# EAGLE design sc14cvm-evb (EAGLE 7.6.0)
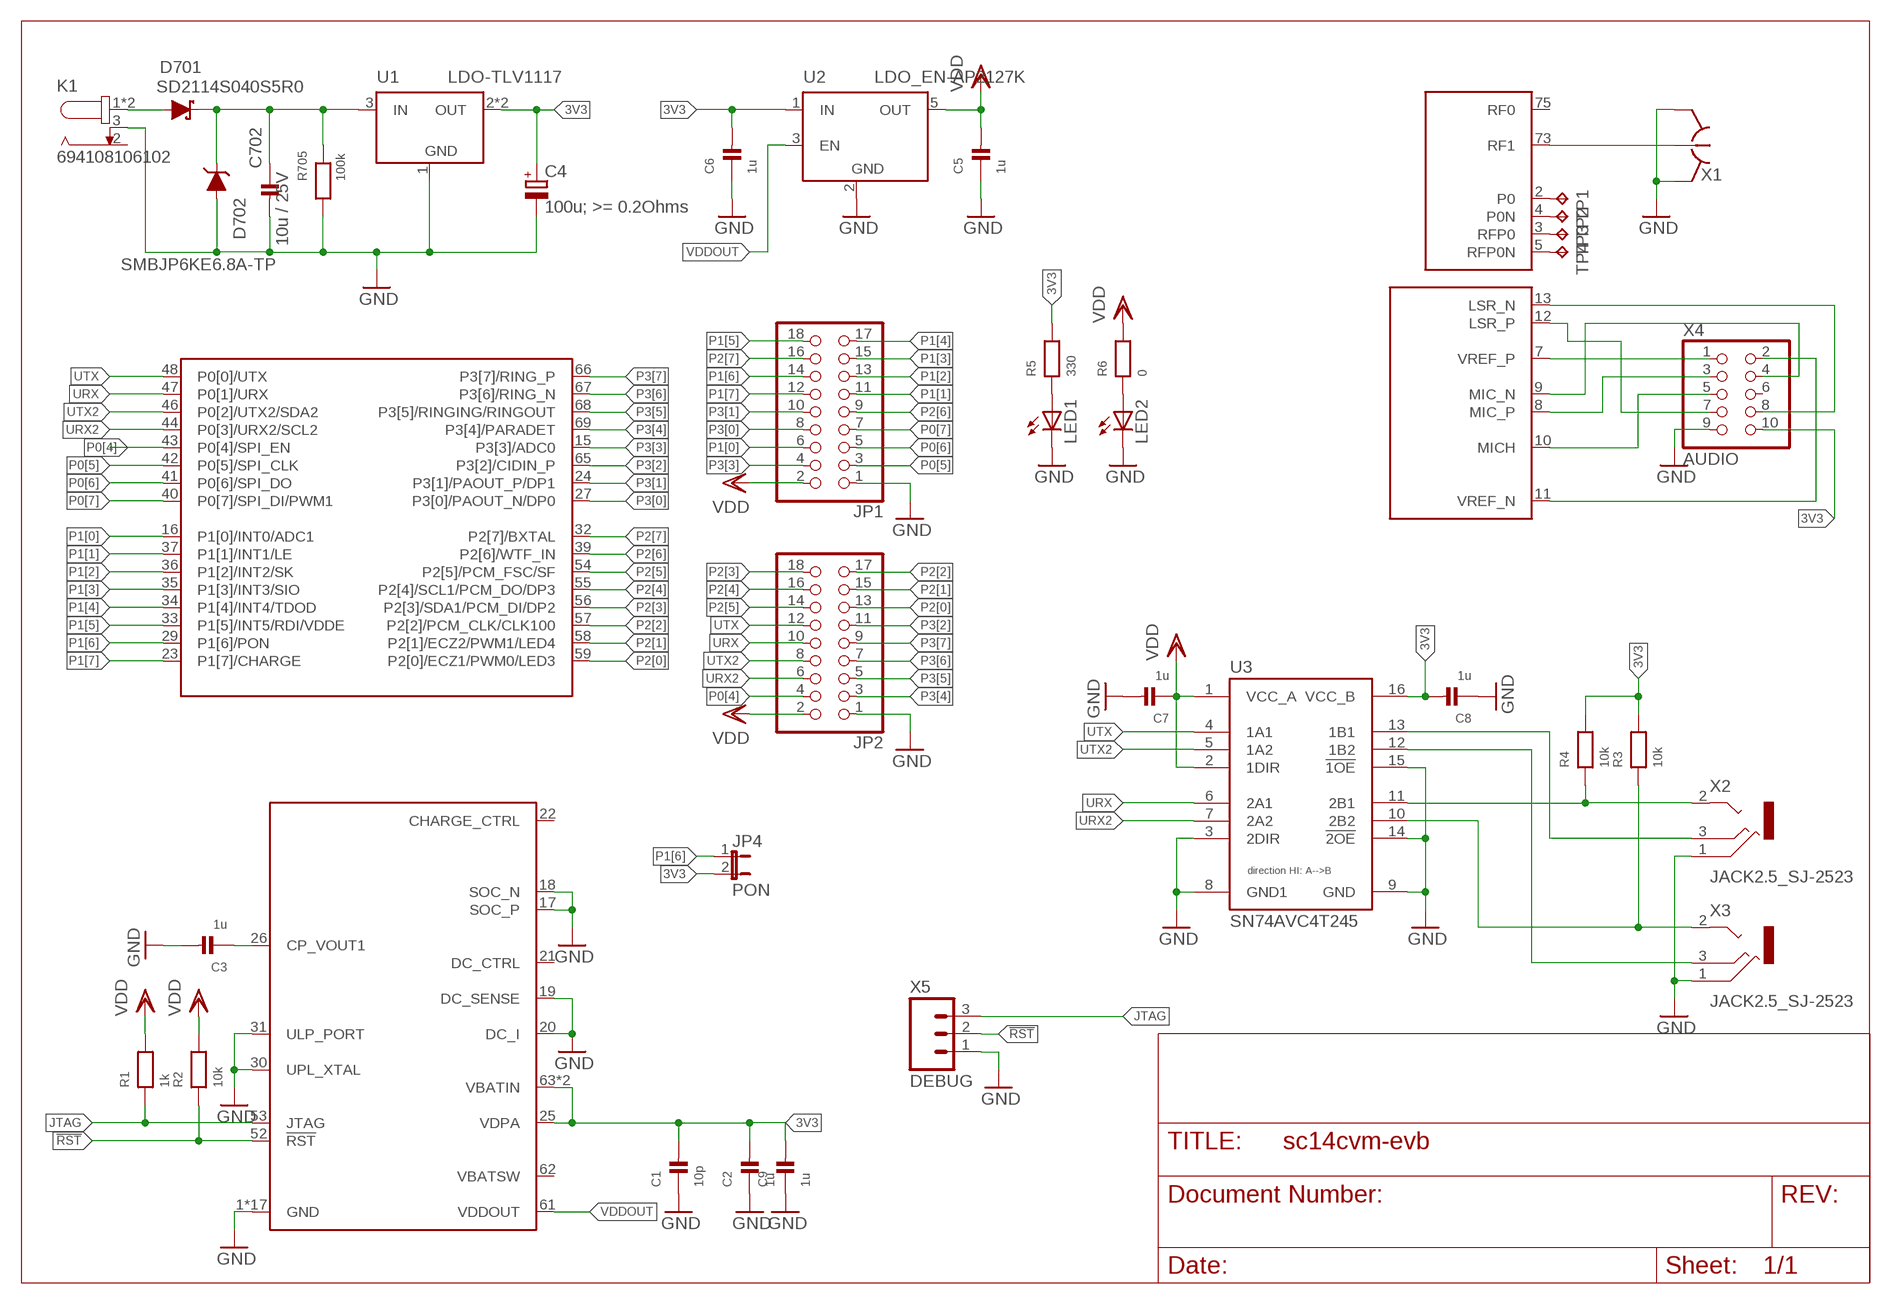
[diagram p0: schematic, sheet 1]

## Parts
C1  10p  CAP_CERAMIC_0402  [_0402]
C2  1u  CAP_CERAMIC_0402  [_0402]
C3  1u  CAP_CERAMIC_0603  [_0603]
C4  100u; >= 0.2Ohms  CPOL-EUSMCB  [SMC_B]
C5  1u  CAP_CERAMIC_0603  [_0603]
C6  1u  CAP_CERAMIC_0603  [_0603]
C7  1u  CAP_CERAMIC_0603  [_0603]
C8  1u  CAP_CERAMIC_0603  [_0603]
C9  1u  CAP_CERAMIC_0402  [_0402]
C702  10u / 25V  CAP_CERAMIC-C1812  [C1812K]
D701  SD2114S040S5R0  DIODE-SCHOTTKY-SMB  [SMBDIODE]
D702  SMBJP6KE6.8A-TP  DIODE-TVS-SMB  [SMBDIODE]
JP1  PINHD-2X9  [2X09]
JP2  PINHD-2X9  [2X09]
JP4  PON  JP1E  [JP1]
K1  694108106102  [694108106102]
LED1  LEDCHIPLED_0603  [CHIPLED_0603]
LED2  LEDCHIPLED_0603  [CHIPLED_0603]
MOD1  SC14CVMDECT  [MOD88]
R1  1k  RESISTOR_0603  [_0603@2]
R2  10k  RESISTOR_0603  [_0603@2]
R3  10k  RESISTOR_0603  [_0603@2]
R4  10k  RESISTOR_0603  [_0603@2]
R5  330  RESISTOR_0603  [_0603@2]
R6  0  RESISTOR_0603  [_0603@2]
R705  100k  RESISTOR_0603  [_0603@2]
TP1  TPTP11R  [TP11R]
TP2  TPTP11R  [TP11R]
TP3  TPTP11R  [TP11R]
TP4  TPTP11R  [TP11R]
U1  LDO-TLV1117  [SOT223]
U2  LDO_EN-AP2127K  [SOT23L]
U3  SN74AVC4T245  [TSSOP16]
X1  HRS_UFL  [HRS_UFL]
X2  JACK2.5_SJ-2523  [JACK2.5_SJ-2523]
X3  JACK2.5_SJ-2523  [JACK2.5_SJ-2523]
X4  AUDIO  PINHD-2X5  [2X05]
X5  DEBUG  PINHD-1X3LOCK_LONGPADS  [1X03_LOCK_LONGPADS]

## Nets
3V3 [usb]: C1.2 C2.2 C4.+ C6.2 C8.2 C9.2 JP4.2 MOD1.25(SUP:VDPA) MOD1.63(SUP:VBATIN) MOD1.64(SUP:VBATIN) R3.2 R4.2 R5.2 U1.2(OUT) U1.4(OUT) U2.1(IN) U3.16(VCC_B) X4.10
!RST: MOD1.52(SUP:!RST) R2.1 X5.2
+VIN_PROT [supply]: C702.1 D701.C D702.C R705.2 U1.3(IN)
GND [usb]: C1.1 C2.1 C3.2 C4.- C5.1 C6.1 C7.2 C8.1 C9.1 C702.2 D702.A JP1.1 JP2.1 K1.3 LED1.C LED2.C MOD1.1(SUP:GND) MOD1.6(SUP:GND) MOD1.14(SUP:GND) MOD1.17(SUP:SOC_P) MOD1.18(SUP:SOC_N) MOD1.19(SUP:DC_SENSE) MOD1.20(SUP:DC_I) MOD1.28(SUP:GND) MOD1.30(SUP:UPL_XTAL) MOD1.31(SUP:ULP_PORT) MOD1.38(SUP:GND) MOD1.45(SUP:GND) MOD1.49(SUP:GND) MOD1.50(SUP:GND) MOD1.51(SUP:GND) MOD1.60(SUP:GND) MOD1.70(SUP:GND) MOD1.71(SUP:GND) MOD1.72(SUP:GND) MOD1.74(SUP:GND) MOD1.76(SUP:GND) MOD1.77(SUP:GND) MOD1.78(SUP:GND) R705.1 U1.1(GND) U2.2(GND) U3.3(2DIR) U3.8(GND1) U3.9(GND) U3.14(!2OE) U3.15(!1OE) X1.GND@1(GND) X1.GND@2(GND) X2.1(RING) X3.1(RING) X4.9 X5.1
JTAG: MOD1.53(SUP:JTAG) R1.1 X5.3
N$1: D701.A K1.1 K1.1-1
N$2: MOD1.7(AUDIO:VREF_P) X4.1
N$3: C3.1 MOD1.26(SUP:CP_VOUT1)
N$4: MOD1.11(AUDIO:VREF_N) X4.2
N$5: MOD1.8(AUDIO:MIC_P) X4.3
N$6: MOD1.9(AUDIO:MIC_N) X4.4
N$7: MOD1.12(AUDIO:LSR_P) X4.7
N$8: MOD1.13(AUDIO:LSR_N) X4.8
N$9: MOD1.10(AUDIO:MICH) X4.5
N$10: MOD1.2(RF:P0) TP1.TP
N$11: MOD1.4(RF:P0N) TP2.TP
N$12: MOD1.3(RF:RFP0) TP3.TP
N$13: MOD1.5(RF:RFP0N) TP4.TP
N$14: LED1.A R5.1
N$15: LED2.A R6.1
P0[4]: JP2.4 MOD1.43(DIG:P0[4]/SPI_EN)
P0[5]: JP1.3 MOD1.42(DIG:P0[5]/SPI_CLK)
P0[6]: JP1.5 MOD1.41(DIG:P0[6]/SPI_DO)
P0[7]: JP1.7 MOD1.40(DIG:P0[7]/SPI_DI/PWM1)
P1[0]: JP1.6 MOD1.16(DIG:P1[0]/INT0/ADC1)
P1[1]: JP1.11 MOD1.37(DIG:P1[1]/INT1/LE)
P1[2]: JP1.13 MOD1.36(DIG:P1[2]/INT2/SK)
P1[3]: JP1.15 MOD1.35(DIG:P1[3]/INT3/SIO)
P1[4]: JP1.17 MOD1.34(DIG:P1[4]/INT4/TDOD)
P1[5]: JP1.18 MOD1.33(DIG:P1[5]/INT5/RDI/VDDE)
P1[6]: JP1.14 JP4.1 MOD1.29(DIG:P1[6]/PON)
P1[7]: JP1.12 MOD1.23(DIG:P1[7]/CHARGE)
P2[0]: JP2.13 MOD1.59(DIG:P2[0]/ECZ1/PWM0/LED3)
P2[1]: JP2.15 MOD1.58(DIG:P2[1]/ECZ2/PWM1/LED4)
P2[2]: JP2.17 MOD1.57(DIG:P2[2]/PCM_CLK/CLK100)
P2[3]: JP2.18 MOD1.56(DIG:P2[3]/SDA1/PCM_DI/DP2)
P2[4]: JP2.16 MOD1.55(DIG:P2[4]/SCL1/PCM_DO/DP3)
P2[5]: JP2.14 MOD1.54(DIG:P2[5]/PCM_FSC/SF)
P2[6]: JP1.9 MOD1.39(DIG:P2[6]/WTF_IN)
P2[7]: JP1.16 MOD1.32(DIG:P2[7]/BXTAL)
P3[0]: JP1.8 MOD1.27(DIG:P3[0]/PAOUT_N/DP0)
P3[1]: JP1.10 MOD1.24(DIG:P3[1]/PAOUT_P/DP1)
P3[2]: JP2.11 MOD1.65(DIG:P3[2]/CIDIN_P)
P3[3]: JP1.4 MOD1.15(DIG:P3[3]/ADC0)
P3[4]: JP2.3 MOD1.69(DIG:P3[4]/PARADET)
P3[5]: JP2.5 MOD1.68(DIG:P3[5]/RINGING/RINGOUT)
P3[6]: JP2.7 MOD1.67(DIG:P3[6]/RING_N)
P3[7]: JP2.9 MOD1.66(DIG:P3[7]/RING_P)
RF1 [eth]: MOD1.73(RF:RF1) X1.SIG
URX: JP2.10 MOD1.47(DIG:P0[1]/URX) U3.6(2A1)
URX2: JP2.6 MOD1.44(DIG:P0[3]/URX2/SCL2) U3.7(2A2)
URX2_3V3: R3.1 U3.10(2B2) X3.2(TIP)
URX_3V3: R4.1 U3.11(2B1) X2.2(TIP)
UTX: JP2.12 MOD1.48(DIG:P0[0]/UTX) U3.4(1A1)
UTX2: JP2.8 MOD1.46(DIG:P0[2]/UTX2/SDA2) U3.5(1A2)
UTX2_3V3: U3.12(1B2) X3.3(MIDDLE)
UTX_3V3: U3.13(1B1) X2.3(MIDDLE)
VDD [usb]: C5.2 C7.1 JP1.2 JP2.2 R1.2 R2.2 R6.2 U2.5(OUT) U3.1(VCC_A) U3.2(1DIR)
VDDOUT [usb]: MOD1.61(SUP:VDDOUT) U2.3(EN)
Unconnected: K1.2 MOD1.21(SUP:DC_CTRL) MOD1.22(SUP:CHARGE_CTRL) MOD1.62(SUP:VBATSW) MOD1.75(RF:RF0) X4.6

## Library data of the parts
C1-C3 C5-C9 = rc-sysmocom:CAP_CERAMIC: Ceramic Capacitors 0402 - 0402 Surface Mount Capacitors 16pF 50V 5% [Digikey: 445-4899-2-ND] 18pF 50V 5% [Digikey: 490-1281-2-ND] 22pF 50V 5% [Digikey: 490-1283-2-ND] 68pF 50V 5% [Digikey: 490-1289-2-ND] 0.1uF 10V 10% [Digikey: 490-1318-2-ND] 1.0uF 6.3V 10% [Digikey: 490-1320-2-ND] 0603 - 0603 Surface Mount Capacitors 16 pF 50V 5% [Digikey: 445-5051-2-ND] 22 pF 50V [Digikey: PCC220ACVTR-ND] 33 pF 50V 5% [Digikey: 490-1415-1-ND] 56pF 50V 5% [Digikey: 490-1421-1-ND] 220pF 50V 5% [Digikey: 445-1285-1-ND] 680 pF 50V 2200 pF 50V 5% C0G [Digikey: 445-1297-1-ND] 5600 pF 100V 5% X7R [Digikey: 478-3711-1-ND] 0.1 µF 25V 10% [Digikey: PCC2277TR-ND] 0.22 µF 16V 10% X7R [Digikey: 445-1318-1-ND] 1.0 µF 25V 10% [Digikey: 445-5146-2-ND] 0603 - RF Specific 3pF 250V +/-0.1pF RF [Digikey: 712-1347-1-ND] 18 pF 250V 5% [Digikey: 478-3505-1-ND or 712-1322-1-ND] 56 pF 250V 5% C0G RF [Digikey: 490-4867-1-ND] 68 pF 250V RF [Digikey: 490-4868-1-ND] 0805 - 0805 Surface Mount Capacitors 220 pF 250V 2% RF Ceramic Capacitor [Digikey: 712-1398-1-ND] 1000 pF 50V 2% NP0 Ceramic Capacitor [Digikey: 478-3760-1-ND] 0.1 µF 25V 10% Ceramic Capacitor [Digikey: PCC1828TR-ND] 1.0 µF 16V 10% Ceramic Capacitor[Digikey: 490-1691-2-ND] 10.0 µF 10V 10% Ceramic Capacitor[Digikey: 709-1228-1-ND] 10.0 uF 16V 10% Ceramic Capacitor [Digikey: 478-5165-2-ND] 47 uF 6.3V 20% Ceramic Capacitor [Digikey: 587-1779-1-ND or 399-5506-1-ND] 1206 - 1206 Surface Mount Capacitors 47uF 10V 20% Ceramic Capacitor [Digikey: 490-5528-1-ND or 399-5508-1-ND or 445-6010-1-ND] 100uF 6.3V -20%, +80% Y5V Ceramic Capacitor (Digikey: 490-4512-1-ND, Mouser: 81-GRM31CF50J107ZE1L) 1810 - 1810 Surface Mount Capacitors High volt MLC; no solder stop between for higher isolation; CLASS: CAPACITOR; DESCRIPTION: NO DESCRIPTION; LINK: UNKNOWN LINK; MANUFACTURER: UNKNOWN MANUFACTURER; MANUFACTURERPARTNUMBER: UNKNOWN MANUFACTURER PART NUMBER; POPULATED: TRUE; ROHSCERTIFICATE: UNKNOWN ROHS CERTIFICATE; SOURCE: UNKNOWN SOURCE; SOURCEPARTNUMBER: UNKNOWN SOURCE PART NUMBER
C4 = rcl:CPOL-EU: POLARIZED CAPACITOR, European symbol; CLASS: CAPACITOR; DESCRIPTION: NO DESCRIPTION; LINK: https://www.digikey.de/product-detail/en/kemet/T495B107M010ATE350/399-18817-1-ND/9642352; MANUFACTURER: UNKNOWN MANUFACTURER; MANUFACTURERPARTNUMBER: UNKNOWN MANUFACTURER PART NUMBER; POPULATED: TRUE; ROHSCERTIFICATE: UNKNOWN ROHS CERTIFICATE; SOURCE: UNKNOWN SOURCE; SOURCEPARTNUMBER: 399-18817-1-ND
C702 = rc-sysmocom:CAP_CERAMIC: Ceramic Capacitors 0402 - 0402 Surface Mount Capacitors 16pF 50V 5% [Digikey: 445-4899-2-ND] 18pF 50V 5% [Digikey: 490-1281-2-ND] 22pF 50V 5% [Digikey: 490-1283-2-ND] 68pF 50V 5% [Digikey: 490-1289-2-ND] 0.1uF 10V 10% [Digikey: 490-1318-2-ND] 1.0uF 6.3V 10% [Digikey: 490-1320-2-ND] 0603 - 0603 Surface Mount Capacitors 16 pF 50V 5% [Digikey: 445-5051-2-ND] 22 pF 50V [Digikey: PCC220ACVTR-ND] 33 pF 50V 5% [Digikey: 490-1415-1-ND] 56pF 50V 5% [Digikey: 490-1421-1-ND] 220pF 50V 5% [Digikey: 445-1285-1-ND] 680 pF 50V 2200 pF 50V 5% C0G [Digikey: 445-1297-1-ND] 5600 pF 100V 5% X7R [Digikey: 478-3711-1-ND] 0.1 µF 25V 10% [Digikey: PCC2277TR-ND] 0.22 µF 16V 10% X7R [Digikey: 445-1318-1-ND] 1.0 µF 25V 10% [Digikey: 445-5146-2-ND] 0603 - RF Specific 3pF 250V +/-0.1pF RF [Digikey: 712-1347-1-ND] 18 pF 250V 5% [Digikey: 478-3505-1-ND or 712-1322-1-ND] 56 pF 250V 5% C0G RF [Digikey: 490-4867-1-ND] 68 pF 250V RF [Digikey: 490-4868-1-ND] 0805 - 0805 Surface Mount Capacitors 220 pF 250V 2% RF Ceramic Capacitor [Digikey: 712-1398-1-ND] 1000 pF 50V 2% NP0 Ceramic Capacitor [Digikey: 478-3760-1-ND] 0.1 µF 25V 10% Ceramic Capacitor [Digikey: PCC1828TR-ND] 1.0 µF 16V 10% Ceramic Capacitor[Digikey: 490-1691-2-ND] 10.0 µF 10V 10% Ceramic Capacitor[Digikey: 709-1228-1-ND] 10.0 uF 16V 10% Ceramic Capacitor [Digikey: 478-5165-2-ND] 47 uF 6.3V 20% Ceramic Capacitor [Digikey: 587-1779-1-ND or 399-5506-1-ND] 1206 - 1206 Surface Mount Capacitors 47uF 10V 20% Ceramic Capacitor [Digikey: 490-5528-1-ND or 399-5508-1-ND or 445-6010-1-ND] 100uF 6.3V -20%, +80% Y5V Ceramic Capacitor (Digikey: 490-4512-1-ND, Mouser: 81-GRM31CF50J107ZE1L) 1810 - 1810 Surface Mount Capacitors High volt MLC; no solder stop between for higher isolation; CLASS: CAPACITOR; DESCRIPTION: CAP CER 10UF 25V X7R 1812; LINK: https://www.digikey.de/product-detail/de/tdk-corporation/C4532X7R1E106M250KA/445-1445-1-ND; MANUFACTURER: TDK Corporation; MANUFACTURERPARTNUMBER: C4532X7R1E106M250KA; POPULATED: TRUE; ROHSCERTIFICATE: Bleifrei / RoHS-konform; SOURCE: DIGIKEY; SOURCEPARTNUMBER: 445-1445-1-ND
D701 = diodes-sysmocom:DIODE-SCHOTTKY: Diode SMA Model Volts Amps Type Vf Vr Digikey # Notes SSA34-E3 40V 3A Schottky 480mV @ 3A 200uA @ 40V SSA34-E3/61TGITR-ND CDBA120-G 20V 1A Schottky 500mV @ 1A 500uA @ 20V 641-1014-6-ND REEL MBRA210 10V 2A Schottky 350mV @ 2A 700uA @ 10V MBRA210LT3 SOD-123 Model Volts Amps Type Vf Vr Order # Notes BAT54T1G 30V 200mA Schottky 800mV @ 200mA 2uA @ 25V BAT54T1GOSTR-ND B0530W 30V 500mA Schottky 430mV @ 500mA 130uA @ 30V B0530W-FDICT-ND REEL MBR120 1A 20V Schottky 340mV @ 1A MBR120VLSFT1GOSCT-ND SOD-323 Model Volts Amps Type Vf Vr Order # Notes PMEG2005EJ 20V 500mA Schottky 355mV @ 500mA 568-4110-1-ND ZLLS410 10V 570mA Schottky 380mV @ 570mA ZLLS410CT-ND 1N4148WS 75V 150mA Silicon/Simple 1V 1N4148WSFSCT-ND REEL SOD-523 Model Volts Amps Type Vf Vr Order # Notes BAT54XV2 30V 200mA Schottky 0.8V @ 100mA BAT54XV2CT-ND TB751S 30V 30mA Schottky RB751S-40TE61CT-ND SOT23-R/W (R = Solder Paste/Reflow Ovens, W = Hand-Soldering) Model Volts Amps Type Vf Vr Order # Notes BAT54FILM 40V 300mA Schottky 497-7162-1-ND; CLASS: DIODE; DESCRIPTION: DIODE SCHOTTKY 40V 5A SMB; LINK: https://www.digikey.de/product-detail/de/avx-corporation/SD2114S040S5R0/478-7816-1-ND; MANUFACTURER: AVX Corporation; MANUFACTURERPARTNUMBER: SD2114S040S5R0; POPULATED: TRUE; ROHSCERTIFICATE: Bleifrei / RoHS-konform; SOURCE: DIGIKEY; SOURCEPARTNUMBER: 478-7816-1-ND
D702 = diodes-sysmocom:DIODE-TVS; CLASS: DIODE; DESCRIPTION: TVS DIODE 5.8V 10.5V DO214AA; LINK: https://www.digikey.de/product-detail/de/micro-commercial-co/SMBJP6KE6.8A-TP/SMBJP6KE6.8A-TPMSCT-ND; MANUFACTURER: Micro Commercial Co; MANUFACTURERPARTNUMBER: SMBJP6KE6.8A-TP; POPULATED: TRUE; ROHSCERTIFICATE: Bleifrei / RoHS-konform; SOURCE: DIGIKEY; SOURCEPARTNUMBER: SMBJP6KE6.8A-TPMSCT-ND
JP1 JP2 = pinhead:PINHD-2X9: PIN HEADER; CLASS: CONNECTOR\JUMPER; DESCRIPTION: NO DESCRIPTION; LINK: https://www.digikey.de/product-detail/en/sullins-connector-solutions/PRPC009DAAN-RC/S2011EC-09-ND/2775285; MANUFACTURER: UNKNOWN MANUFACTURER; MANUFACTURERPARTNUMBER: UNKNOWN MANUFACTURER PART NUMBER; POPULATED: TRUE; ROHSCERTIFICATE: UNKNOWN ROHS CERTIFICATE; SOURCE: UNKNOWN SOURCE; SOURCEPARTNUMBER: UNKNOWN SOURCE PART NUMBER
JP4 = jumper:JP1E: JUMPER; CLASS: CONNECTOR\JUMPER; DESCRIPTION: NO DESCRIPTION; LINK: UNKNOWN LINK; MANUFACTURER: UNKNOWN MANUFACTURER; MANUFACTURERPARTNUMBER: UNKNOWN MANUFACTURER PART NUMBER; POPULATED: TRUE; ROHSCERTIFICATE: UNKNOWN ROHS CERTIFICATE; SOURCE: UNKNOWN SOURCE; SOURCEPARTNUMBER: UNKNOWN SOURCE PART NUMBER
K1 = Wurth_Elektronik_Electromechanic_DC_Power_Jack_Connectors_rev15c:694108106102: WR-DC_DC Power Jack_Right Angled_SMT Center Pin Ø2.5_Plug ID Ø2.55_Plug OD Ø5.5_with 4 Soldering Pad & Peg ;=>Code : Con_WR-DC_SMT_694108106102_694108106102 <http://katalog.we-online.de/media/images/eican/Con_WR-DC_SMT_694108106102_pf2.jpg> Details see: http://katalog.we-online.de/em/datasheet/6941xx106102.pdf Created 2014-10-08, Karrer Zheng 2014 (C) Wurth Elektronik; CLASS: RELAY; DESCRIPTION: NO DESCRIPTION; LINK: UNKNOWN LINK; MANUFACTURER: UNKNOWN MANUFACTURER; MANUFACTURERPARTNUMBER: UNKNOWN MANUFACTURER PART NUMBER; POPULATED: TRUE; ROHSCERTIFICATE: UNKNOWN ROHS CERTIFICATE; SOURCE: UNKNOWN SOURCE; SOURCEPARTNUMBER: UNKNOWN SOURCE PART NUMBER
LED1 = led:LED: LED OSRAM: - CHIPLED LG R971, LG N971, LY N971, LG Q971, LY Q971, LO R971, LY R971 LH N974, LH R974 LS Q976, LO Q976, LY Q976 LO Q996 - Hyper CHIPLED LW Q18S LB Q993, LB Q99A, LB R99A - SideLED LS A670, LO A670, LY A670, LG A670, LP A670 LB A673, LV A673, LT A673, LW A673 LH A674 LY A675 LS A676, LA A676, LO A676, LY A676, LW A676 LS A679, LY A679, LG A679 - Hyper Micro SIDELED® LS Y876, LA Y876, LO Y876, LY Y876 LT Y87S - SmartLED LW L88C, LW L88S LB L89C, LB L89S, LG L890 LS L89K, LO L89K, LY L89K LS L896, LA L896, LO L896, LY L896 - TOPLED LS T670, LO T670, LY T670, LG T670, LP T670 LSG T670, LSP T670, LSY T670, LOP T670, LYG T670 LG T671, LOG T671, LSG T671 LB T673, LV T673, LT T673, LW T673 LH T674 LS T676, LA T676, LO T676, LY T676, LB T676, LH T676, LSB T676, LW T676 LB T67C, LV T67C, LT T67C, LS T67K, LO T67K, LY T67K, LW E67C LS E67B, LA E67B, LO E67B, LY E67B, LB E67C, LV E67C, LT E67C LW T67C LS T679, LY T679, LG T679 LS T770, LO T770, LY T770, LG T770, LP T770 LB T773, LV T773, LT T773, LW T773 LH T774 LS E675, LA E675, LY E675, LS T675 LS T776, LA T776, LO T776, LY T776, LB T776 LHGB T686 LT T68C, LB T68C - Hyper Mini TOPLED® LB M676 - Mini TOPLED Santana® LG M470 LS M47K, LO M47K, LY M47K Source: http://www.osram.convergy.de LUXEON: - LUMILED® LXK2-PW12-R00, LXK2-PW12-S00, LXK2-PW14-U00, LXK2-PW14-V00 LXK2-PM12-R00, LXK2-PM12-S00, LXK2-PM14-U00 LXK2-PE12-Q00, LXK2-PE12-R00, LXK2-PE12-S00, LXK2-PE14-T00, LXK2-PE14-U00 LXK2-PB12-K00, LXK2-PB12-L00, LXK2-PB12-M00, LXK2-PB14-N00, LXK2-PB14-P00, LXK2-PB14-Q00 LXK2-PR12-L00, LXK2-PR12-M00, LXK2-PR14-Q00, LXK2-PR14-R00 LXK2-PD12-Q00, LXK2-PD12-R00, LXK2-PD12-S00 LXK2-PH12-R00, LXK2-PH12-S00 LXK2-PL12-P00, LXK2-PL12-Q00, LXK2-PL12-R00 Source: www.luxeon.com KINGBRIGHT: KA-3528ASYC Source: www.kingbright.com; CLASS: LED; DESCRIPTION: NO DESCRIPTION; LINK: UNKNOWN LINK; MANUFACTURER: UNKNOWN MANUFACTURER; MANUFACTURERPARTNUMBER: UNKNOWN MANUFACTURER PART NUMBER; POPULATED: TRUE; ROHSCERTIFICATE: UNKNOWN ROHS CERTIFICATE; SOURCE: UNKNOWN SOURCE; SOURCEPARTNUMBER: UNKNOWN SOURCE PART NUMBER
LED2 = led:LED: LED OSRAM: - CHIPLED LG R971, LG N971, LY N971, LG Q971, LY Q971, LO R971, LY R971 LH N974, LH R974 LS Q976, LO Q976, LY Q976 LO Q996 - Hyper CHIPLED LW Q18S LB Q993, LB Q99A, LB R99A - SideLED LS A670, LO A670, LY A670, LG A670, LP A670 LB A673, LV A673, LT A673, LW A673 LH A674 LY A675 LS A676, LA A676, LO A676, LY A676, LW A676 LS A679, LY A679, LG A679 - Hyper Micro SIDELED® LS Y876, LA Y876, LO Y876, LY Y876 LT Y87S - SmartLED LW L88C, LW L88S LB L89C, LB L89S, LG L890 LS L89K, LO L89K, LY L89K LS L896, LA L896, LO L896, LY L896 - TOPLED LS T670, LO T670, LY T670, LG T670, LP T670 LSG T670, LSP T670, LSY T670, LOP T670, LYG T670 LG T671, LOG T671, LSG T671 LB T673, LV T673, LT T673, LW T673 LH T674 LS T676, LA T676, LO T676, LY T676, LB T676, LH T676, LSB T676, LW T676 LB T67C, LV T67C, LT T67C, LS T67K, LO T67K, LY T67K, LW E67C LS E67B, LA E67B, LO E67B, LY E67B, LB E67C, LV E67C, LT E67C LW T67C LS T679, LY T679, LG T679 LS T770, LO T770, LY T770, LG T770, LP T770 LB T773, LV T773, LT T773, LW T773 LH T774 LS E675, LA E675, LY E675, LS T675 LS T776, LA T776, LO T776, LY T776, LB T776 LHGB T686 LT T68C, LB T68C - Hyper Mini TOPLED® LB M676 - Mini TOPLED Santana® LG M470 LS M47K, LO M47K, LY M47K Source: http://www.osram.convergy.de LUXEON: - LUMILED® LXK2-PW12-R00, LXK2-PW12-S00, LXK2-PW14-U00, LXK2-PW14-V00 LXK2-PM12-R00, LXK2-PM12-S00, LXK2-PM14-U00 LXK2-PE12-Q00, LXK2-PE12-R00, LXK2-PE12-S00, LXK2-PE14-T00, LXK2-PE14-U00 LXK2-PB12-K00, LXK2-PB12-L00, LXK2-PB12-M00, LXK2-PB14-N00, LXK2-PB14-P00, LXK2-PB14-Q00 LXK2-PR12-L00, LXK2-PR12-M00, LXK2-PR14-Q00, LXK2-PR14-R00 LXK2-PD12-Q00, LXK2-PD12-R00, LXK2-PD12-S00 LXK2-PH12-R00, LXK2-PH12-S00 LXK2-PL12-P00, LXK2-PL12-Q00, LXK2-PL12-R00 Source: www.luxeon.com KINGBRIGHT: KA-3528ASYC Source: www.kingbright.com; CLASS: LED; DESCRIPTION: NO DESCRIPTION; LINK: https://www.digikey.de/product-detail/en/LY+L29K-J1K2-26-Z/475-2794-1-ND/1938961; MANUFACTURER: UNKNOWN MANUFACTURER; MANUFACTURERPARTNUMBER: UNKNOWN MANUFACTURER PART NUMBER; POPULATED: TRUE; ROHSCERTIFICATE: UNKNOWN ROHS CERTIFICATE; SOURCE: UNKNOWN SOURCE; SOURCEPARTNUMBER: 475-2794-1-ND
MOD1 = sc14cvmdect:SC14CVMDECT: Sitel SC14CVMDECT module; CLASS: UNKNOWN CLASS; DESCRIPTION: NO DESCRIPTION; LINK: UNKNOWN LINK; MANUFACTURER: UNKNOWN MANUFACTURER; MANUFACTURERPARTNUMBER: UNKNOWN MANUFACTURER PART NUMBER; POPULATED: TRUE; ROHSCERTIFICATE: UNKNOWN ROHS CERTIFICATE; SOURCE: UNKNOWN SOURCE; SOURCEPARTNUMBER: UNKNOWN SOURCE PART NUMBER
R1-R6 = rc-sysmocom:RESISTOR: Resistors 0402 - 0402 Surface Mount Package 22 Ohm 1% 1/16W [Digikey: 311-22.0LRTR-ND] 33 Ohm 5% 1/16W 1.0K 5% 1/16W 1.5K 5% 1/16W 2.0K 1% 1/16W 10.0K 1% 1/16W [Digikey: 311-10.0KLRTR-ND] 10.0K 5% 1/16W [Digikey: RMCF0402JT10K0TR-ND] 12.1K 1% 1/16W [Digikey: 311-22.0LRTR-ND] 100.0K 5% 1/16W 0603 - 0603 Surface Mount Package 1/10 Watt 0805 - 0805 Surface Mount Package 1/8 Watt 1206 - 1206 Surface Mount Package 2012 - 2010 Surface Mount Package 0.11 Ohm 1/2 Watt 1% Resistor - Digikey: RHM.11UCT-ND; CLASS: RESISTOR; DESCRIPTION: NO DESCRIPTION; LINK: UNKNOWN LINK; MANUFACTURER: UNKNOWN MANUFACTURER; MANUFACTURERPARTNUMBER: UNKNOWN MANUFACTURER PART NUMBER; POPULATED: TRUE; ROHSCERTIFICATE: UNKNOWN ROHS CERTIFICATE; SOURCE: UNKNOWN SOURCE; SOURCEPARTNUMBER: UNKNOWN SOURCE PART NUMBER
R705 = rc-sysmocom:RESISTOR: Resistors 0402 - 0402 Surface Mount Package 22 Ohm 1% 1/16W [Digikey: 311-22.0LRTR-ND] 33 Ohm 5% 1/16W 1.0K 5% 1/16W 1.5K 5% 1/16W 2.0K 1% 1/16W 10.0K 1% 1/16W [Digikey: 311-10.0KLRTR-ND] 10.0K 5% 1/16W [Digikey: RMCF0402JT10K0TR-ND] 12.1K 1% 1/16W [Digikey: 311-22.0LRTR-ND] 100.0K 5% 1/16W 0603 - 0603 Surface Mount Package 1/10 Watt 0805 - 0805 Surface Mount Package 1/8 Watt 1206 - 1206 Surface Mount Package 2012 - 2010 Surface Mount Package 0.11 Ohm 1/2 Watt 1% Resistor - Digikey: RHM.11UCT-ND; CLASS: RESISTOR; DESCRIPTION: RES SMD 100K OHM 1%% 1/10W 0603; LINK: https://www.digikey.de/product-detail/de/vishay-dale/CRCW0603100KFKEA/541-100KHCT-ND; MANUFACTURER: Vishay Dale; MANUFACTURERPARTNUMBER: CRCW0603100KFKEA; POPULATED: TRUE; ROHSCERTIFICATE: Bleifrei / RoHS-konform; SOURCE: DIGIKEY; SOURCEPARTNUMBER: 541-100KHCT-ND
TP1-TP4 = testpad:TP: Test pad; CLASS: UNKNOWN CLASS; DESCRIPTION: NO DESCRIPTION; LINK: UNKNOWN LINK; MANUFACTURER: UNKNOWN MANUFACTURER; MANUFACTURERPARTNUMBER: UNKNOWN MANUFACTURER PART NUMBER; POPULATED: TRUE; ROHSCERTIFICATE: UNKNOWN ROHS CERTIFICATE; SOURCE: UNKNOWN SOURCE; SOURCEPARTNUMBER: UNKNOWN SOURCE PART NUMBER
U1 = ldo:LDO; CLASS: IC; DESCRIPTION: NO DESCRIPTION; LINK: https://www.digikey.de/product-detail/en/texas-instruments/TLV1117-33CDCYR/296-21112-1-ND/1217055; MANUFACTURER: UNKNOWN MANUFACTURER; MANUFACTURERPARTNUMBER: UNKNOWN MANUFACTURER PART NUMBER; POPULATED: TRUE; ROHSCERTIFICATE: UNKNOWN ROHS CERTIFICATE; SOURCE: UNKNOWN SOURCE; SOURCEPARTNUMBER: UNKNOWN SOURCE PART NUMBER
U2 = ldo:LDO_EN: Diodes Inc AP2127 300mA high-speed low-noise CMOS LDO (fixed); CLASS: IC; DESCRIPTION: NO DESCRIPTION; LINK: https://www.digikey.de/product-detail/en/AP2127K-1.8TRG1/AP2127K-1.8TRG1DICT-ND/4505274/?itemSeq=301069147; MANUFACTURER: UNKNOWN MANUFACTURER; MANUFACTURERPARTNUMBER: AP2127K-1.8TRG1; POPULATED: TRUE; ROHSCERTIFICATE: UNKNOWN ROHS CERTIFICATE; SOURCE: UNKNOWN SOURCE; SOURCEPARTNUMBER: AP2127K-1.8TRG1DICT-ND
U3 = laforge:SN74AVC4T245: IC @VQFN16: exp pad float or GND; CLASS: IC; DESCRIPTION: NO DESCRIPTION; LINK: https://www.digikey.de/product-detail/en/texas-instruments/SN74AVC4T245PWR/296-18056-1-ND/770944; MANUFACTURER: UNKNOWN MANUFACTURER; MANUFACTURERPARTNUMBER: UNKNOWN MANUFACTURER PART NUMBER; OC_DIGIKEY: 296-18056-1-ND; POPULATED: TRUE; ROHSCERTIFICATE: UNKNOWN ROHS CERTIFICATE; SOURCE: UNKNOWN SOURCE; SOURCEPARTNUMBER: UNKNOWN SOURCE PART NUMBER
X1 = laforge:HRS_UFL: Hirose U.FL SMT; CLASS: CONNECTOR; DESCRIPTION: NO DESCRIPTION; LINK: UNKNOWN LINK; MANUFACTURER: UNKNOWN MANUFACTURER; MANUFACTURERPARTNUMBER: UNKNOWN MANUFACTURER PART NUMBER; OC_DIGIKEY: H9161CT-ND; POPULATED: TRUE; ROHSCERTIFICATE: UNKNOWN ROHS CERTIFICATE; SOURCE: UNKNOWN SOURCE; SOURCEPARTNUMBER: UNKNOWN SOURCE PART NUMBER
X2 X3 = laforge:JACK2.5_SJ-2523: CUI Inc. SJ-2523-SMT; CLASS: CONNECTOR; DESCRIPTION: NO DESCRIPTION; LINK: UNKNOWN LINK; MANUFACTURER: UNKNOWN MANUFACTURER; MANUFACTURERPARTNUMBER: UNKNOWN MANUFACTURER PART NUMBER; OC_DIGIKEY: CP-2523SJCT-ND; POPULATED: TRUE; ROHSCERTIFICATE: UNKNOWN ROHS CERTIFICATE; SOURCE: UNKNOWN SOURCE; SOURCEPARTNUMBER: UNKNOWN SOURCE PART NUMBER
X4 = laforge:PINHD-2X5: PIN HEADER; CLASS: CONNECTOR; DESCRIPTION: NO DESCRIPTION; LINK: https://www.digikey.de/product-detail/en/PRPC005DAAN-RC/S2011EC-05-ND/2775289; MANUFACTURER: UNKNOWN MANUFACTURER; MANUFACTURERPARTNUMBER: UNKNOWN MANUFACTURER PART NUMBER; POPULATED: TRUE; ROHSCERTIFICATE: UNKNOWN ROHS CERTIFICATE; SOURCE: UNKNOWN SOURCE; SOURCEPARTNUMBER: UNKNOWN SOURCE PART NUMBER
X5 = laforge:PINHD-1X3: Header 3 Standard 3-pin 0.1" header; CLASS: CONNECTOR; DESCRIPTION: NO DESCRIPTION; LINK: UNKNOWN LINK; MANUFACTURER: UNKNOWN MANUFACTURER; MANUFACTURERPARTNUMBER: UNKNOWN MANUFACTURER PART NUMBER; POPULATED: TRUE; ROHSCERTIFICATE: UNKNOWN ROHS CERTIFICATE; SOURCE: UNKNOWN SOURCE; SOURCEPARTNUMBER: UNKNOWN SOURCE PART NUMBER

## Net classes
3 supply: width 0.6 mm, clearance 0.3 mm

## Board
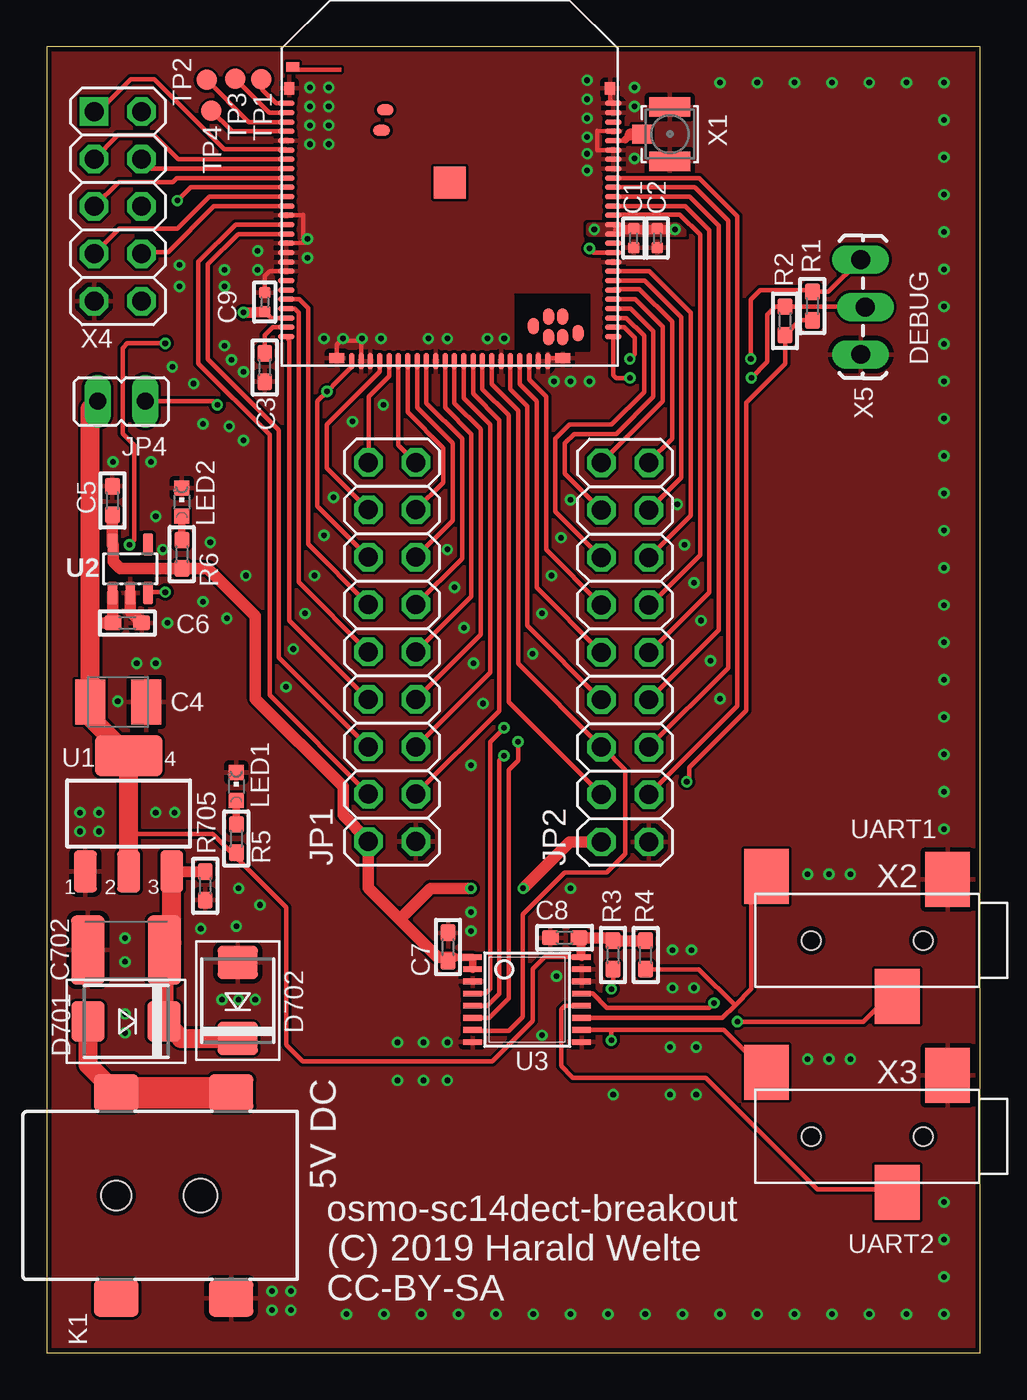
[diagram p1: board, top side]
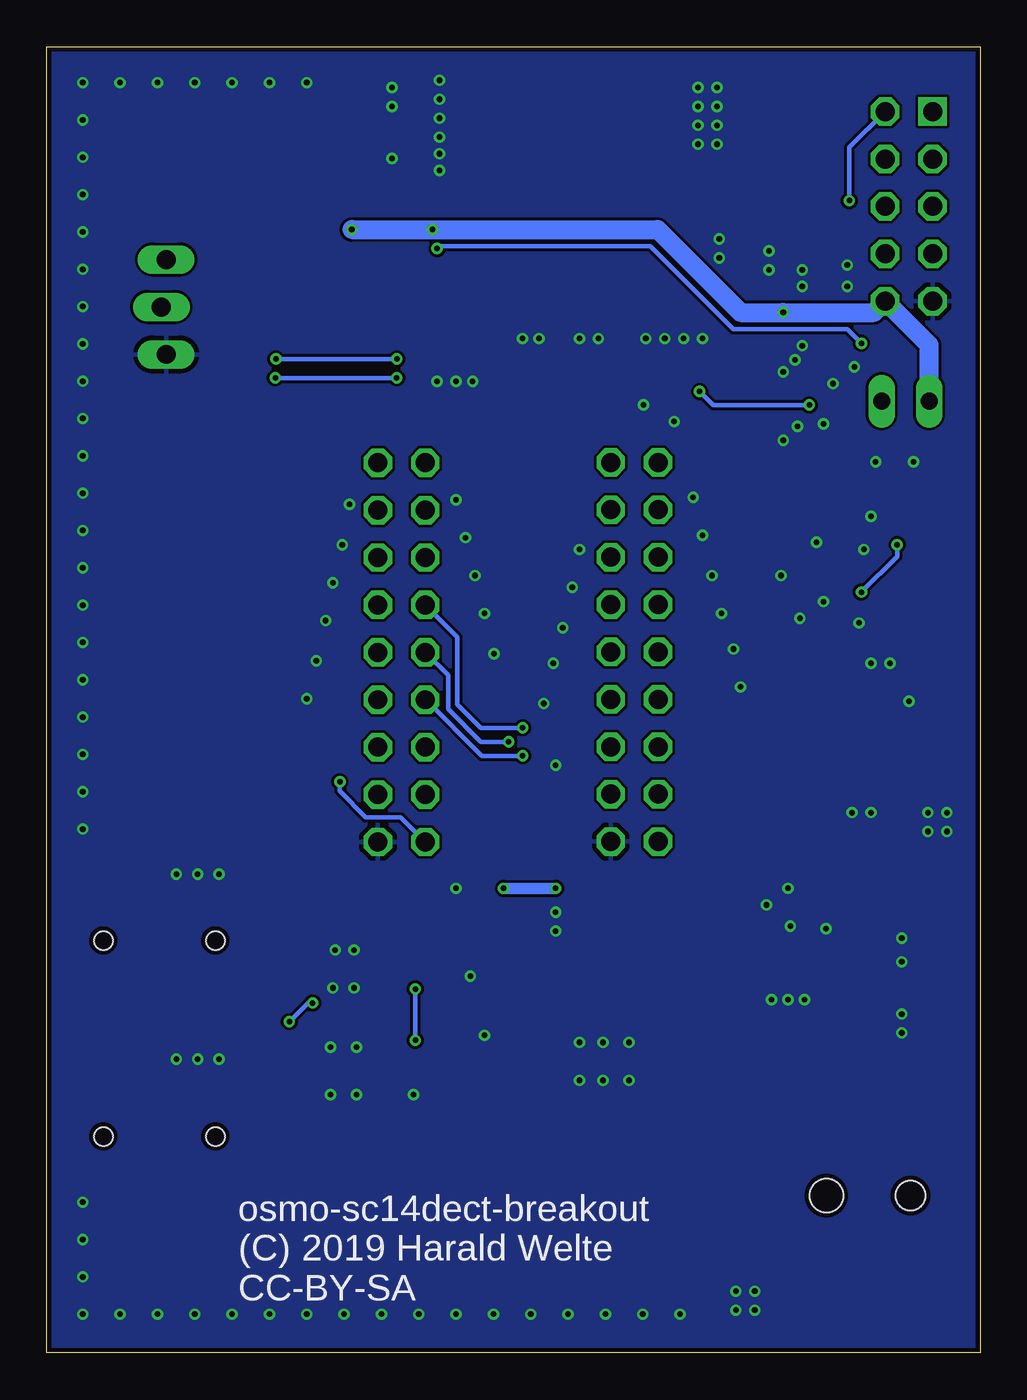
[diagram p2: board, bottom side, seen from below]

Size 50 x 70 mm. Coordinates in mm from the lower left corner, seen from the top.
Outline: 0,0 50,0 50,70 0,70 0,0
Copper layers (1*16): Top 0.035mm / dielectric 1.5mm / Bottom 0.035mm
Design rules "SeeedStudio_2layer_DRU_no_angle_20140221": minimum track width 6mil, minimum drill 12mil, track to track 6mil, track to pad 6mil, pad to pad 6mil, via to via 6mil, smd to smd 0mil, copper to edge 10mil, drill to drill 10mil, minimum pad ring 10mil, minimum via ring 6mil, stop-mask expansion 2mil, vias tented up to drill 100mil, thermal gap 10mil

### Footprints (pad centres in the part's own frame; a part is rotated, then mirrored left to right if it is on the bottom)
_0402 = smd 0.6 x 0.6: 1 -0.508,0; 2 0.508,0
_0603 = smd 0.9 x 0.8: 1 -0.762,0; 2 0.762,0
SMC_B = smd 1.6 x 2.4: + -1.5,0; - 1.5,0
C1812K = smd 1.8 x 3.7: 1 -2.05,0; 2 2.05,0
SMBDIODE = smd 1.78 x 2.16: A 2.04,0; C -2.03,0
2X09 = drill 1.016 octagon: 1 -10.16,-1.27; 2 -10.16,1.27; 3 -7.62,-1.27; 4 -7.62,1.27; 5 -5.08,-1.27; 6 -5.08,1.27; 7 -2.54,-1.27; 8 -2.54,1.27; 9 0,-1.27; 10 0,1.27; 11 2.54,-1.27; 12 2.54,1.27; 13 5.08,-1.27; 14 5.08,1.27; 15 7.62,-1.27; 16 7.62,1.27; 17 10.16,-1.27; 18 10.16,1.27
JP1 = drill 0.914 long: 1 0,-1.27; 2 0,1.27
694108106102 = smd 2.4 x 2: 1 11.15,5.5; 1-1 5,5.5; 2 5,-5.5; 3 11.15,-5.5 | hole 1.6: 5,0 | hole 1.8: 9.5,0
CHIPLED_0603 = smd 0.8 x 0.8: A 0,-0.75; C 0,0.75
MOD88 = smd 0.55 x 0.66: 1 -8.595,5.05; 78 8.595,5.05 | smd 0.89 x 0.3: 2 -8.765,4.25; 3 -8.765,3.75; 4 -8.765,3.25; 5 -8.765,2.75; 6 -8.765,2.25; 7 -8.75,1.75; 8 -8.75,1.25; 9 -8.765,0.75; 10 -8.765,0.25; 11 -8.765,-0.25; 12 -8.765,-0.75; 13 -8.765,-1.25; 14 -8.765,-1.75; 15 -8.765,-2.25; 16 -8.765,-2.75; 17 -8.765,-3.25; 18 -8.765,-3.75; 19 -8.765,-4.25; 20 -8.765,-4.75; 21 -8.765,-5.25; 22 -8.765,-5.75; 23 -8.765,-6.25; 24 -8.765,-6.75; 25 -8.765,-7.25; 26 -8.765,-7.75; 27 -8.765,-8.25; 52 8.765,-8.25; 53 8.765,-7.75; 54 8.765,-7.25; 55 8.765,-6.75; 56 8.765,-6.25; 57 8.765,-5.75; 58 8.765,-5.25; 59 8.765,-4.75; 60 8.765,-4.25; 61 8.765,-3.75; 62 8.765,-3.25; 63 8.765,-2.75; 64 8.765,-2.25; 65 8.765,-1.75; 66 8.765,-1.25; 67 8.765,-0.75; 68 8.765,-0.25; 69 8.765,0.25; 70 8.765,0.75; 71 8.765,1.25; 72 8.765,1.75; 73 8.765,2.25; 74 8.765,2.75; 75 8.765,3.25; 76 8.765,3.75; 77 8.765,4.25 | smd 0.8 x 0.55: 28 -6.05,-9.405; 51 6.05,-9.405 | smd 0.3 x 0.89: 29 -5.25,-9.575; 30 -4.75,-9.575; 31 -4.25,-9.575; 32 -3.75,-9.575; 33 -3.25,-9.575; 34 -2.75,-9.575; 35 -2.25,-9.575; 36 -1.75,-9.575; 37 -1.25,-9.575; 38 -0.75,-9.575; 39 -0.25,-9.575; 40 0.25,-9.575; 41 0.75,-9.575; 42 1.25,-9.575; 43 1.75,-9.575; 44 2.25,-9.575; 45 2.75,-9.575; 46 3.25,-9.575; 47 3.75,-9.575; 48 4.25,-9.575; 49 4.75,-9.575; 50 5.25,-9.575 | smd 0.7 x 0.5: 79 -8.4,6.2 | smd 1.7 x 1.7: 80 0,0 | smd 0.9 x 0.6: 81 -3.45,3.9; 82 -3.65,2.8 | smd 0.6 x 0.9: 83 4.48,-7.68; 84 5.3,-8.28; 85 5.3,-7.17; 86 6.05,-8.28; 87 6.05,-7.17; 88 6.88,-8.07
_0603@2 = smd 0.9 x 0.8: 1 -0.762,0; 2 0.762,0
TP11R = smd 1.1 x 1.1: TP 0,0
SOT223 = smd 1.219 x 2.235: 1 -2.311,-3.099; 2 0,-3.099; 3 2.311,-3.099 | smd 3.6 x 2.2: 4 0,3.099
SOT23L = smd 0.55 x 1.2: 1 -0.95,-1.3; 2 0,-1.3; 3 0.95,-1.3; 4 0.95,1.3; 5 -0.95,1.3
TSSOP16 = smd 0.305 x 0.991: 1 -2.275,-2.918; 2 -1.625,-2.918; 3 -0.975,-2.918; 4 -0.325,-2.918; 5 0.325,-2.918; 6 0.975,-2.918; 7 1.625,-2.918; 8 2.275,-2.918; 9 2.275,2.918; 10 1.625,2.918; 11 0.975,2.918; 12 0.325,2.918; 13 -0.325,2.918; 14 -0.975,2.918; 15 -1.625,2.918; 16 -2.275,2.918
HRS_UFL = smd 1.05 x 2.2: GND@1 -1.452,0; GND@2 1.452,0 | smd 1 x 1.05: SIG 0,-1.502
JACK2.5_SJ-2523 = smd 2.4 x 2.94: 1 -4.3,-3.274; 2 5.4,-3.424; 3 -1.6,3 | hole 1: -3,0; 3,0
2X05 = drill 1.016 square: 1 -5.08,-1.27 | drill 1.016 octagon: 2 -5.08,1.27; 3 -2.54,-1.27; 4 -2.54,1.27; 5 0,-1.27; 6 0,1.27; 7 2.54,-1.27; 8 2.54,1.27; 9 5.08,-1.27; 10 5.08,1.27
1X03_LOCK_LONGPADS = drill 1.016 long: 1 0,0; 2 2.54,-0.254; 3 5.08,0

### Placement (x,y rotation side)
C1  31.45,59.74 90 top
C2  32.72,59.74 90 top
C3  11.68,52.8 270 top
C4  3.83,34.88 0 top
C5  3.52,45.68 270 top
C6  4.32,39.11 180 top
C7  21.5,21.75 90 top
C8  27.75,22.25 0 top
C9  11.68,56.31 270 top
C702  4.26,21.59 180 top
D701  4.26,17.76 180 top
D702  10.24,18.88 90 top
JP1  18.51,37.56 90 top
JP2  30.99,37.54 90 top
JP4  4,51 90 top
K1  -1.27,8.43 0 top
LED1  10.16,30.35 0 top
LED2  7.24,45.59 0 top
MOD1  21.59,62.71 0 top
R1  41.02,56.1 270 top
R2  39.56,55.3 270 top
R3  30.34,21.32 90 top
R4  32.09,21.32 90 top
R5  10.16,27.56 270 top
R6  7.24,42.8 270 top
R705  8.49,25.03 90 top
TP1  11.51,68.25 0 top
TP2  8.57,68.22 0 top
TP3  10.1,68.28 0 top
TP4  8.83,66.57 0 top
U1  4.39,28.9 0 top
U2  4.48,42.02 0 top
U3  25.74,18.93 270 top
X1  33.38,65.31 270 top
X2  43.96,22.1 180 top
X3  43.96,11.6 180 top
X4  3.81,61.44 270 top
X5  43.6,53.51 90 top

### Tracks (layer width: path | path; a pad name or v marks a point on that pad's centre or on a via)
3V3  (via drill 0.3)
  Top 0.152: 8.89,27.81 9.91,26.8 R5.2
  Top 0.254: MOD1.25 12.03,55.46 C9.2 | MOD1.63 30.59,60.2 | C8.2 28.51,21.27 28.57,21.21 26.67,21.21 26.04,20.57 26.04,17.78 23.88,15.62 13.72,15.62 12.83,16.51 12.83,23.88 8.89,27.81 4.52,27.81 4.39,27.94
  Top 0.406: U3.16 28.66,22.1 C8.2
  Top 0.5: 30.59,60.2 v33.66,60.2
  Top 0.6: v10.54,55.75 C9.2
  Top 0.61: R4.2 R3.2 30.17,22.25 C8.2 | U2.1 3.53,39.14 C6.2 2.38,39.11 2.33,39.16
  Top 1.016: U1.2 4.39,27.94 U1.4 2.33,34.06 C4.+ 2.33,39.16 2.33,50.6 JP4.2
  Bottom 1.016: v33.66,60.2 17.27,60.2 12.83,55.75 v10.54,55.75 5.69,55.75 X4.10 2.73,54.01 JP4.2
  other vias: 29.34,60.2
  pour Top (no thermals): 29.21,60.37 33.78,60.37 34.16,59.99 29.21,59.99
  pour Top (no thermals): 29.08,60.37 33.66,60.37 34.04,59.99 29.08,59.99
!RST  (via drill 0.3)
  Top 0.254: MOD1.52 30.36,52.4 30.5,52.25 v31.25,52.25 | 39.57,56.05 X5.2 | 39.57,56.05 R2.1 | 39.57,56.05 39.04,56.05 38.61,55.63 38.61,53.11 v37.75,52.25
  Bottom 0.254: v31.25,52.25 v37.75,52.25
+VIN_PROT
  Top 0.6: U1.3 6.71,25.79 R705.2
  Top 1.016: D702.C 7.2,16.85 D701.C 6.31,17.78 C702.1 6.7,21.98 U1.3
GND  (via drill 0.3)
  Top 0.254: MOD1.78 30.18,67.13 MOD1.77 | MOD1.51 27.01,53.3 MOD1.50 | MOD1.28 15.54,54.04 15.75,54.25 16.75,54.25 16.84,54.16 MOD1.30 | MOD1.14 13.71,60.96 arc90 13.75,61 13.75,59.75 arc90 14,59.5 MOD1.17 | MOD1.74 29.5,65.5 29.5,64.46 MOD1.72 | MOD1.20 11.94,57.96 11.68,57.71 C9.1
  Top 0.61: U2.2 4.48,39.72 C6.1
  other vias: 33.53,21.59 34.54,21.59 34.67,19.56 33.53,19.56 33.4,16.38 34.8,16.38 27.3,20.19 43.05,15.75 41.91,15.75 40.77,15.75 40.77,25.65 41.91,25.65 43.05,25.65 12.06,3.3 12.06,2.29 13.08,2.29 13.08,3.3 33.4,13.84 34.8,13.84 30.35,13.84 9.4,18.92 10.29,18.92 11.18,18.92 4.19,22.23 4.19,20.95 4.19,18.16 4.19,17.14 1.78,27.94 2.79,27.94 2.79,28.96 1.78,28.96 4.83,36.96 5.84,36.96 3.81,34.92 22.73,23.62 22.73,22.61 26.54,17.02 28.07,24.89 22.73,31.5 23.37,34.8 22.86,36.96 22.35,38.86 21.84,41.02 16.38,49.91 18.03,50.8 21.46,43.05 15.37,45.85 14.86,43.81 14.35,41.66 13.84,39.62 13.21,37.72 12.83,35.69 34.16,43.31 34.67,41.27 35.05,39.24 35.56,37.08 36.07,35.05 26.04,37.47 26.54,39.62 27.05,41.66 27.56,43.69 28.07,45.72 33.78,45.47 27.18,52.07 28.07,52.07 29.08,52.07 28.96,68.2 28.96,67.18 28.96,66.17 28.96,65.15 28.96,64.26 28.96,63.37 31.5,66.8 31.5,64.01 31.5,67.82 13.97,58.67 13.97,59.69 14.86,54.36 15.88,54.36 16.89,54.36 17.91,54.36 20.45,54.36 21.46,54.36 24.51,54.36 23.62,54.36 14.1,67.82 15.11,67.82 14.1,66.8 14.1,65.79 14.1,64.77 15.11,66.8 15.11,65.79 15.11,64.77 3.56,47.75 10.67,41.66 21.46,16.64 20.19,16.64 20.19,14.61 21.46,14.61 18.8,14.61 18.8,16.64 10.29,24.89 11.43,24 10.16,22.86 8.26,22.73 5.84,28.96 6.86,28.96 10.54,48.9 8.38,49.78 9.78,49.66 6.22,43.05 8.76,43.43 8.38,40.26 9.65,39.37 6.48,39.12 5.59,47.75 5.84,44.83 11.3,59.05 11.3,58.04 9.53,57.15 9.53,58.04 9.53,53.98 9.91,53.21 10.54,52.58 7.87,51.94 6.73,52.83 7.11,57.15 7.11,58.29 36.07,68.07 38.07,68.07 40.07,68.07 42.07,68.07 44.07,68.07 46.07,68.07 48.07,68.07 48.07,66.07 48.07,64.07 48.07,62.07 48.07,60.07 48.07,58.07 48.07,56.07 48.07,54.07 48.07,52.07 48.07,50.07 48.07,48.07 48.07,46.07 48.07,44.07 48.07,42.07 48.07,40.07 48.07,38.07 48.07,36.07 48.07,34.07 48.07,32.07 48.07,30.07 48.07,28.07 48.07,8.07 48.07,6.07 48.07,4.07 48.07,2.07 46.07,2.07 42.07,2.07 44.07,2.07 40.07,2.07 38.07,2.07 36.07,2.07 34.07,2.07 32.07,2.07 30.07,2.07 28.07,2.07 26.07,2.07 24.07,2.07 20.07,2.07 22.07,2.07 18.07,2.07 16.07,2.07
  pour Top (rank 2): 0,70 50,70 50,0 0,0
  pour Bottom: 0,70 50,70 50,0 0,0
JTAG  (via drill 0.3)
  Top 0.254: MOD1.53 30.94,54.96 31.5,54.4 31.5,53.52 v31.24,53.26 | v37.72,53.26 37.72,56.44 38.23,56.94 40.93,56.94 R1.1 41.88,56.86 X5.3 43.22,58.2
  Bottom 0.254: v31.24,53.26 v37.72,53.26
N$1
  Top 1.016: K1.1-1 2.22,15.44 D701.A
  Top 1.676: K1.1-1 K1.1
N$2
  Top 0.254: MOD1.7 12.8,64.5 9.5,64.5 5.75,68.25 4.5,68.25 2.77,66.52 X4.1
N$3
  Top 0.254: MOD1.26 12.11,54.96 11.68,54.53 C3.1
N$4  (via drill 0.3)
  Top 0.254: MOD1.11 7.71,62.46 v7,61.75
  Bottom 0.254: v7,61.75 7,64.6 X4.2
N$5
  Top 0.254: MOD1.8 7.04,63.96 5.75,65.25 3.81,65.25 X4.3
N$6
  Top 0.254: MOD1.9 5.6,63.46 X4.4
N$7
  Top 0.254: MOD1.12 8.71,61.96 7,60.25 3.89,60.25 X4.7
N$8
  Top 0.254: MOD1.13 8.96,61.46 6.5,59 5.18,59 X4.8
N$9
  Top 0.254: MOD1.10 6.96,62.96 6.75,62.75 3.85,62.75 X4.5
N$10
  Top 0.254: MOD1.2 12.29,66.96 11.56,67.69 11.56,68.2 TP1.TP
N$11
  Top 0.254: MOD1.4 10.83,65.96 TP2.TP
N$12
  Top 0.254: MOD1.3 11.92,66.46 TP3.TP
N$13
  Top 0.254: MOD1.5 9.93,65.46 TP4.TP
N$14
  Top 0.406: LED1.A R5.1
N$15
  Top 0.406: R6.1 LED2.A
P0[4]
  Top 0.254: MOD1.43 23.34,51.66 24.75,50.25 24.75,34.89 JP2.4
P0[5]
  Top 0.254: MOD1.42 22.84,51.41 24.25,50 24.25,34.41 JP1.3
P0[6]
  Top 0.254: MOD1.41 22.34,51.16 23.75,49.75 23.75,36.45 JP1.5
P0[7]
  Top 0.254: MOD1.40 21.84,50.91 23.25,49.5 23.25,38.49 JP1.7
P1[0]
  Top 0.254: JP1.6 12.45,37.27 12.45,49.45 8.64,53.26 8.64,58.34 10.26,59.96 MOD1.16
P1[1]
  Top 0.254: MOD1.37 20.34,50.91 22.25,49 22.25,42.57 JP1.11
P1[2]
  Top 0.254: MOD1.36 19.84,50.66 21.75,48.75 21.75,44.61 JP1.13
P1[3]
  Top 0.254: MOD1.35 19.34,50.41 21.25,48.5 21.25,46.65 JP1.15
P1[4]
  Top 0.254: MOD1.34 18.84,48.66 JP1.17
P1[5]
  Top 0.254: MOD1.33 18.34,52.34 17.25,51.25 JP1.18
P1[6]  (via drill 0.3)
  Top 0.254: MOD1.29 16.34,52.84 15.6,52.1 v15.02,51.52 14.5,51 14.5,45.38 JP1.14 | JP4.1 8.94,51 v9.14,50.8
  Bottom 0.254: v9.14,50.8 14.3,50.8 v15.02,51.52
P1[7]
  Top 0.254: MOD1.23 13.54,56.46 14,56 14,43.34 JP1.12
P2[0]
  Top 0.254: MOD1.59 32.29,57.96 34.5,55.75 34.5,44.86 JP2.13
P2[1]
  Top 0.254: MOD1.58 32.04,57.46 34,55.5 34,46.9 JP2.15
P2[2]
  Top 0.254: JP2.17 32.26,47.76 33.5,49 33.5,55.25 31.75,57 30.39,57 MOD1.57
P2[3]
  Top 0.254: MOD1.56 31.54,56.46 33,55 33,51 30,48 29.75,47.73 JP2.18
P2[4]
  Top 0.254: MOD1.55 31.29,55.96 32.5,54.75 32.5,51.25 30.5,49.25 28.25,49.25 27.75,48.75 27.75,47.13 JP2.16
P2[5]
  Top 0.254: MOD1.54 31.04,55.46 32,54.5 32,51.5 30.25,49.75 28,49.75 27.25,49 27.25,45.09 JP2.14
P2[6]
  Top 0.254: MOD1.39 21.34,50.66 22.75,49.25 22.75,40.53 JP1.9
P2[7]
  Top 0.254: MOD1.32 17.84,52.59 15,49.75 15,47.42 JP1.16
P3[0]
  Top 0.254: JP1.8 13,39.25 13,54.28 MOD1.27
P3[1]
  Top 0.254: MOD1.24 13.29,55.96 13.5,55.75 13.5,41.3 JP1.10
P3[2]
  Top 0.254: JP2.11 32.33,40.08 35,42.75 35,59.92 33.92,61 30.39,61 MOD1.65
P3[3]
  Top 0.254: JP1.4 11.94,35.24 11.94,49.2 8.13,53.01 8.13,58.47 10.12,60.46 MOD1.15
P3[4]
  Top 0.254: JP2.3 37,34.66 37,60.92 34.96,62.96 MOD1.69
P3[5]
  Top 0.254: JP2.5 36.5,36.7 36.5,60.67 34.71,62.46 MOD1.68
P3[6]
  Top 0.254: JP2.7 36,38.74 36,60.42 34.46,61.96 MOD1.67
P3[7]
  Top 0.254: JP2.9 32.29,37.54 35.5,40.75 35.5,60.17 34.21,61.46 MOD1.66
RF1
  Top 0.254: MOD1.73 30.92,64.96 30.99,65.02
  Top 0.406: 30.99,65.02 31.24,65.28
  Top 0.6: 31.24,65.28 31.27,65.31 X1.SIG
URX  (via drill 0.3)
  Top 0.254: MOD1.47 25.34,51.91 26.25,51 26.25,41.01 JP2.10 | v25.25,32.75 25.25,31.75 24.75,31.25 24.75,19 23.7,17.95 U3.6
  Bottom 0.254: JP2.10 28.5,36.32 28.5,34.5 26.75,32.75 v25.25,32.75
URX2
  Top 0.254: MOD1.44 23.84,51.91 25.25,50.5 25.25,36.93 JP2.6 29.79,32.46 31,31.25 31,26.75 30,25.75 27.75,25.75 25.5,23.5 25.5,18 24.75,17.25 22.88,17.25 U3.7
URX2_3V3  (via drill 0.3)
  Top 0.254: U3.10 30.25,17.3 | 30.25,17.3 36.28,17.3 X3.2 | R3.1 30.34,19.59 v30.25,19.5 | v30.25,16.75 30.25,17.3
  Bottom 0.254: v30.25,19.5 v30.25,16.75
URX_3V3
  Top 0.254: U3.11 36.2,17.95 36.88,18.62 | 36.88,18.62 37.75,19.5 37.75,24.71 X2.2 | R4.1 34.94,20.56 36.88,18.62
UTX  (via drill 0.3)
  Top 0.254: MOD1.48 25.84,52.16 26.75,51.25 26.75,43.05 JP2.12 | U3.4 23.5,19.25 23.75,19.5 23.75,32.75 v24.5,33.5
  Bottom 0.254: JP2.12 28,38.36 28,34.75 26.75,33.5 v24.5,33.5
UTX2  (via drill 0.3)
  Top 0.254: MOD1.46 24.84,51.66 25.75,50.75 25.75,38.97 JP2.8 | v24.5,32 24.25,31.75 24.25,19.25 23.61,18.61 U3.5
  Bottom 0.254: JP2.8 29.72,35.03 26.69,32 v24.5,32
UTX2_3V3
  Top 0.254: 45.41,8.75 X3.3 45.4,8.76 41.27,8.76 35.31,14.73 28.19,14.73 27.56,15.37 27.56,18.41 27.75,18.61 U3.12
UTX_3V3  (via drill 0.3)
  Top 0.254: U3.13 29.25,19.25 30,18.5 35.5,18.5 v35.75,18.75 | v37,17.75 43.75,17.75 44.75,18.75 45.21,18.75 X2.3
  Bottom 0.254: v35.75,18.75 36,18.75 v37,17.75
VDD  (via drill 0.3)
  Top 0.254: R1.2 40.35,55.34 R2.2 39.56,53.02 37.47,50.93 37.47,34.42 34.42,31.37 34.42,30.73 v34.29,30.61
  Top 0.406: U3.2 U3.1 21.72,21.2 C7.1
  Top 0.61: C5.2 U2.5 3.56,43.29 3.56,42.42 3.94,42.04 R6.2 8.64,42.04 11.18,39.5 11.18,35.05 15.88,30.35 15.88,28.83 17.24,27.46 JP1.2 17.24,24.92 18.92,23.24 | 21.72,21.2 20.96,21.2 18.92,23.24 | JP2.2 28.02,27.38 v25.53,24.89 | v22.73,24.89 20.57,24.89 18.92,23.24
  Bottom 0.254: v34.29,30.61 34.29,30.1 32.89,28.7 31.04,28.7 JP2.2
  Bottom 0.61: v25.53,24.89 v22.73,24.89
VDDOUT  (via drill 0.3)
  Top 0.254: MOD1.61 29.43,58.96 arc-90 v29.08,59.18 | v6.35,54.1 4.32,54.1 4.06,53.85 4.06,49.28 4.7,48.64 4.7,43.56 v4.45,43.31 | v6.35,40.77 5.48,40.77 U2.3
  Bottom 0.254: v29.08,59.18 29.08,59.31 17.65,59.31 13.21,54.86 7.11,54.86 v6.35,54.1 | v4.45,43.31 4.45,42.67 v6.35,40.77

### Text on the board
tNames: DEBUG | UART1 | 5V DC | UART2 | osmo-sc14dect-breakout / (C) 2019 Harald Welte / CC-BY-SA
bNames: osmo-sc14dect-breakout / (C) 2019 Harald Welte / CC-BY-SA